# Altium schematic sheet Led_Matrix_Main.schDoc
size A3; CompanyName: Anfaengineering; Organization: Anfaengineering; Address1: Timisoara; Address2: Romania; SheetNumber: 3; SheetTotal: 5
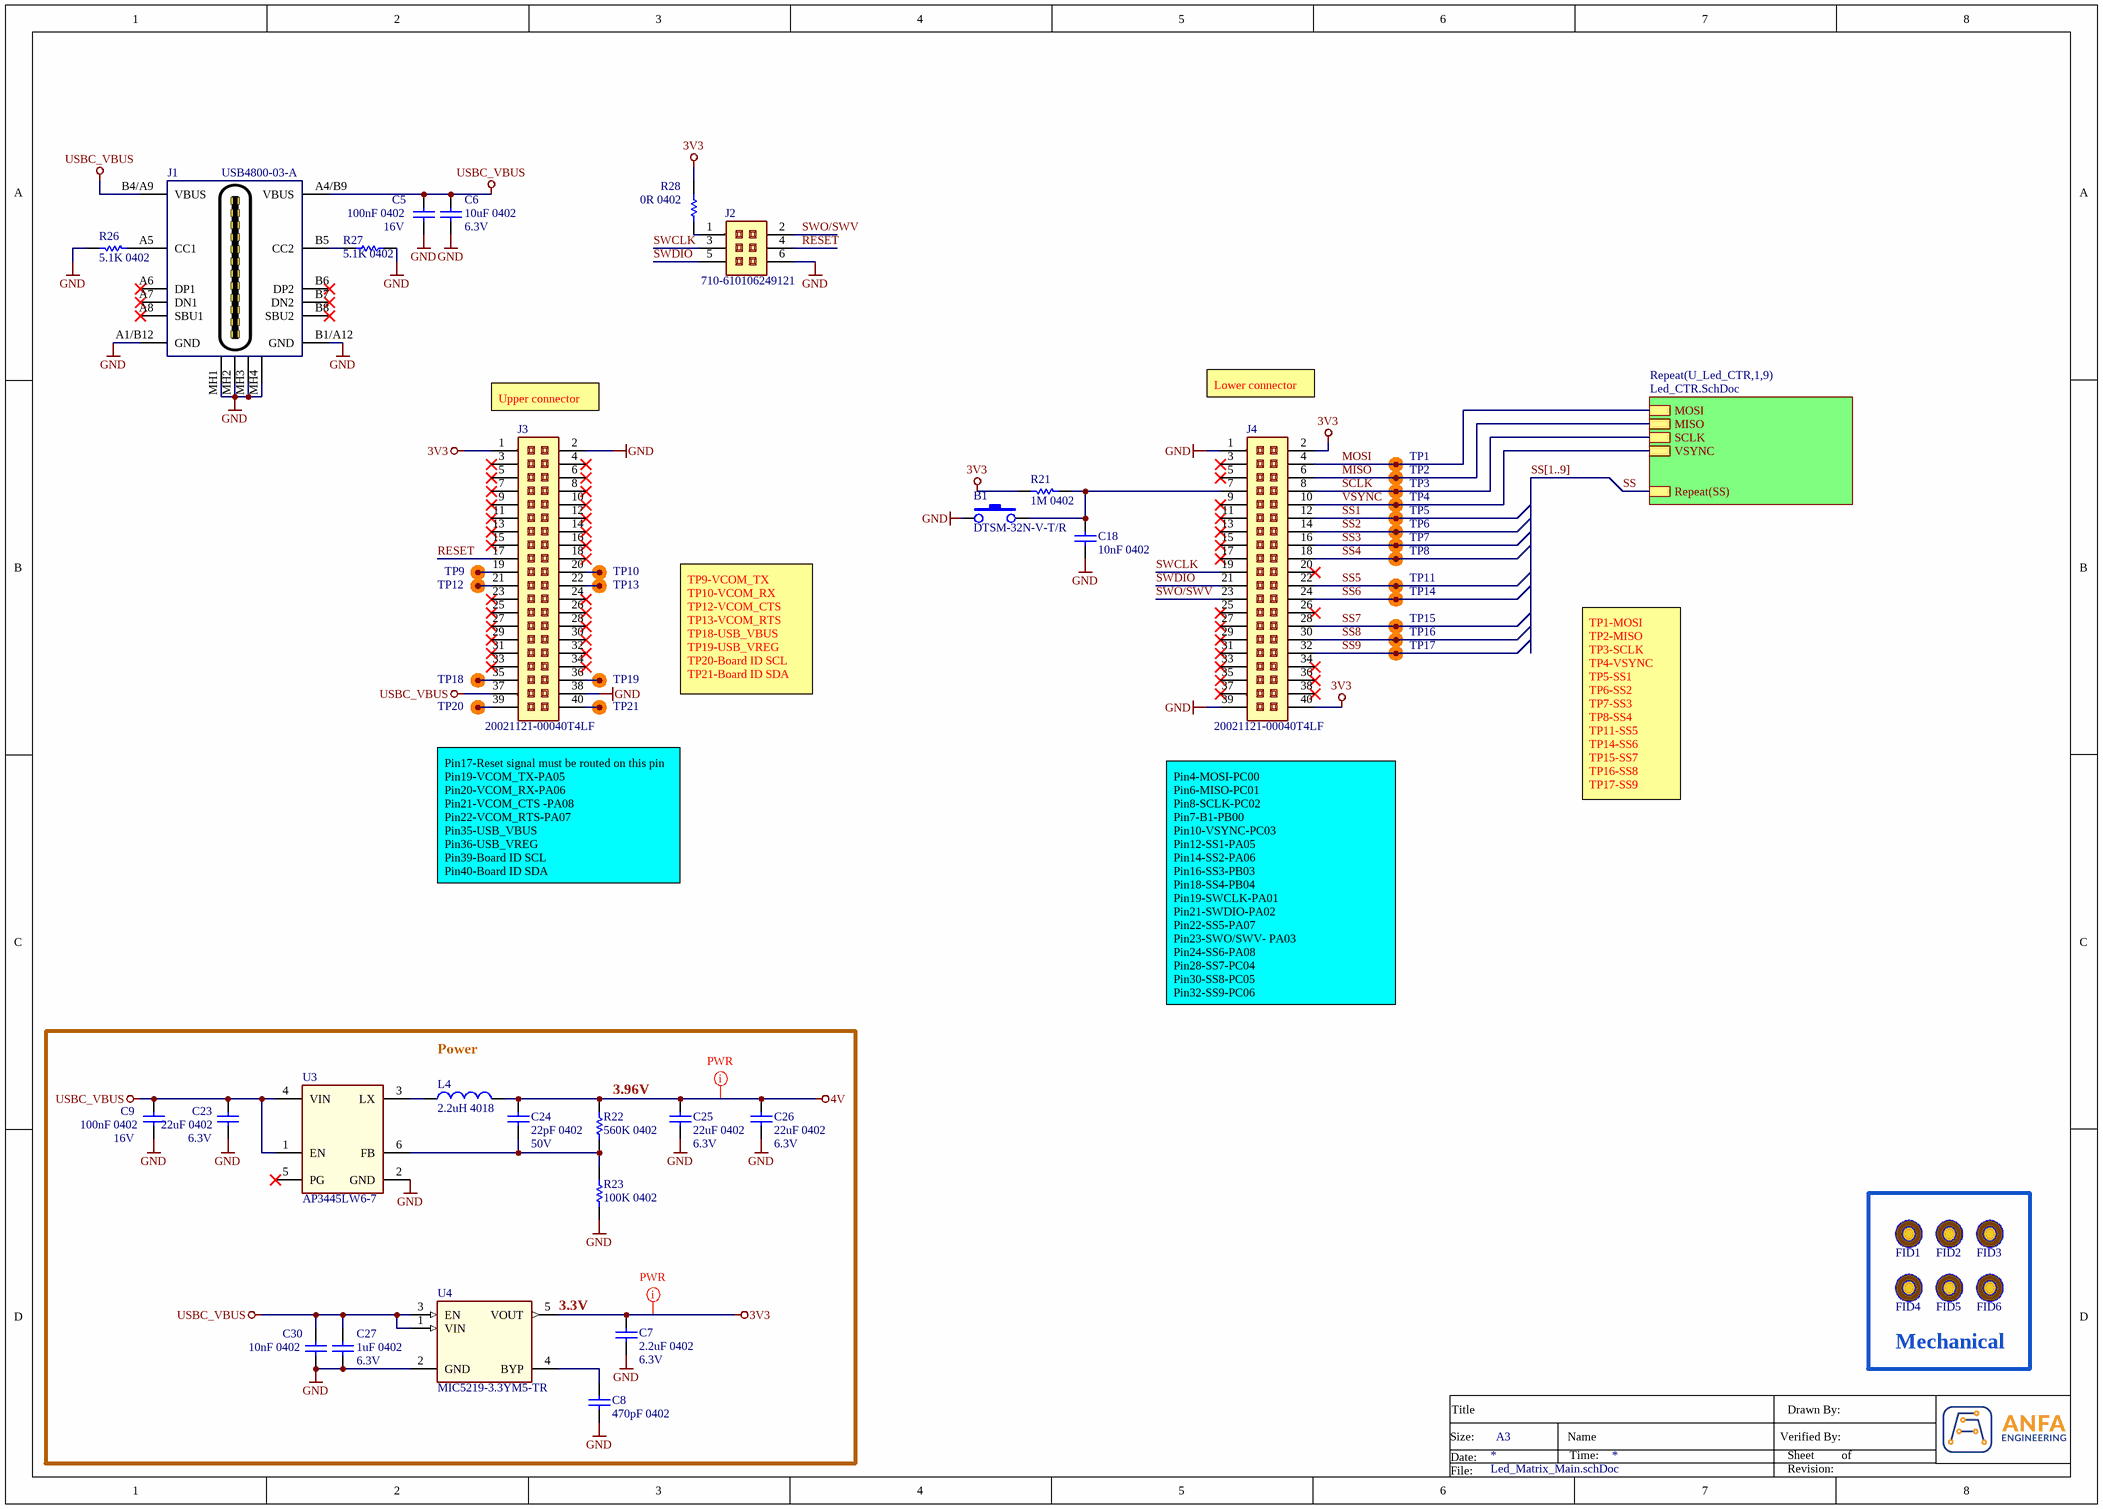
[diagram p0: Led_Matrix_Main.schDoc]

## Parts
B1  DTSM-32N-V-T/R  [DTSM-32N-V]
C5  100nF 0402  Voltage: 16V  [CAPC0402(1005)70]
C6  10uF 0402  Voltage: 6.3V  [CAPC0402(1005)70]
C7  2.2uF 0402  Voltage: 6.3V  [CAPC0402(1005)70]
C8  470pF 0402  [CAPC0402(1005)33]
C9  100nF 0402  Voltage: 16V  [CAPC0402(1005)70]
C18  10nF 0402  [CAPC0402(1005)33]
C23  22uF 0402  Voltage: 6.3V  [CAPC0402(1005)70]
C24  22pF 0402  Voltage: 50V  [CAPC0402(1005)70]
C25  22uF 0402  Voltage: 6.3V  [CAPC0402(1005)70]
C26  22uF 0402  Voltage: 6.3V  [CAPC0402(1005)70]
C27  1uF 0402  Voltage: 6.3V  [CAPC0402(1005)70]
C30  10nF 0402  [CAPC0402(1005)33]
FID1  (no value)  [FID1]  (no BOM)
FID2  (no value)  [FID1]  (no BOM)
FID3  (no value)  [FID1]  (no BOM)
FID4  (no value)  [FID1]  (no BOM)
FID5  (no value)  [FID1]  (no BOM)
FID6  (no value)  [FID1]  (no BOM)
J1  USB4800-03-A  [USB4800-03-A]
J2  710-610106249121  [HDR_2X3_2.54mm_MALE]
J3  20021121-00040T4LF  [20021121-00040T4LF]
J4  20021121-00040T4LF  [20021121-00040T4LF]
L4  2.2uH 4018  [SMD4018]
R21  1M 0402  [RESC0402(1005)]
R22  560K 0402  [RESC0402(1005)]
R23  100K 0402  [RESC0402(1005)]
R26  5.1K 0402  [RESC0402(1005)]
R27  5.1K 0402  [RESC0402(1005)]
R28  0R 0402  [RESC0402(1005)]
TP1  (no value)  [TP_SMD]  (no BOM)
TP2  (no value)  [TP_SMD]  (no BOM)
TP3  (no value)  [TP_SMD]  (no BOM)
TP4  (no value)  [TP_SMD]  (no BOM)
TP5  (no value)  [TP_SMD]  (no BOM)
TP6  (no value)  [TP_SMD]  (no BOM)
TP7  (no value)  [TP_SMD]  (no BOM)
TP8  (no value)  [TP_SMD]  (no BOM)
TP9  (no value)  [TP_SMD]  (no BOM)
TP10  (no value)  [TP_SMD]  (no BOM)
TP11  (no value)  [TP_SMD]  (no BOM)
TP12  (no value)  [TP_SMD]  (no BOM)
TP13  (no value)  [TP_SMD]  (no BOM)
TP14  (no value)  [TP_SMD]  (no BOM)
TP15  (no value)  [TP_SMD]  (no BOM)
TP16  (no value)  [TP_SMD]  (no BOM)
TP17  (no value)  [TP_SMD]  (no BOM)
TP18  (no value)  [TP_SMD]  (no BOM)
TP19  (no value)  [TP_SMD]  (no BOM)
TP20  (no value)  [TP_SMD]  (no BOM)
TP21  (no value)  [TP_SMD]  (no BOM)
U3  AP3445LW6-7  [SOT23-6]
U4  MIC5219-3.3YM5-TR  [SOT23-5]

## Blocks framed on the sheet
Mechanical: FID1-FID6

## Sub-sheets
Repeat(U_Led_CTR,1,9) = Led_CTR.SchDoc: MOSI, MISO, VSYNC, SCLK, Repeat(SS)

## Nets
3V3: C7.2 J3.1 J4.2 J4.40 R21.1 R28.2 U4.5(VOUT)
4V: C24.2 C25.1 C26.1 L4.2 R22.2
GND: B1.2 C5.1 C6.1 C7.1 C8.1 C9.1 C18.1 C23.1 C25.2 C26.2 C27.1 C30.1 J1.A1/B12(GND) J1.B1/A12(GND) J1.MH1 J1.MH2 J1.MH3 J1.MH4 J2.6 J3.2 J3.38 J4.1 J4.39 R23.1 R26.2 R27.2 U3.2(GND) U4.2(GND)
USBC_VBUS: C5.2 C6.2 C9.2 C23.2 C27.2 C30.2 J1.A4/B9(VBUS) J1.B4/A9(VBUS) J3.37 U3.1(EN) U3.4(VIN) U4.1(VIN) U4.3(EN)
MISO: J4.6 TP2.1 ; sheet Repeat(U_Led_CTR,1,9)/MISO
MOSI: J4.4 TP1.1 ; sheet Repeat(U_Led_CTR,1,9)/MOSI
RESET: J2.4 J3.17
SCLK: J4.8 TP3.1 ; sheet Repeat(U_Led_CTR,1,9)/SCLK
SS: sheet Repeat(U_Led_CTR,1,9)/Repeat(SS)
SS1: J4.12 TP5.1
SS2: J4.14 TP6.1
SS3: J4.16 TP7.1
SS4: J4.18 TP8.1
SS5: J4.22 TP11.1
SS6: J4.24 TP14.1
SS7: J4.28 TP15.1
SS8: J4.30 TP16.1
SS9: J4.32 TP17.1
SWCLK: J2.3 J4.19
SWDIO: J2.5 J4.21
SWO/SWV: J2.2 J4.23
VSYNC: J4.10 TP4.1 ; sheet Repeat(U_Led_CTR,1,9)/VSYNC
NetB1_1: B1.1 C18.2 J4.7 R21.2
NetC8_2: C8.2 U4.4(BYP)
NetC24_1: C24.1 R22.1 R23.2 U3.6(FB)
NetJ1_A5: J1.A5(CC1) R26.1
NetJ1_B5: J1.B5(CC2) R27.1
NetJ2_1: J2.1 R28.1
NetJ3_19: J3.19 TP9.1
NetJ3_20: J3.20 TP10.1
NetJ3_21: J3.21 TP12.1
NetJ3_22: J3.22 TP13.1
NetJ3_35: J3.35 TP18.1
NetJ3_36: J3.36 TP19.1
NetJ3_39: J3.39 TP20.1
NetJ3_40: J3.40 TP21.1
NetL4_1: L4.1 U3.3(LX)

Not connected (* = marked no-connect by the designer): J1 A6(DP1)* A7(DN1)* A8(SBU1)* B6(DP2)* B7(DN2)* B8(SBU2)*; J3 3* 4* 5* 6* 7* 8* 9* 10* 11* 12* 13* 14* 15* 16* 18* 23* 24* 25* 26* 27* 28* 29* 30* 31* 32* 33* 34*; J4 3* 5* 9* 11* 13* 15* 17* 20* 25* 26* 27* 29* 31* 33* 34* 35* 36* 37* 38*; U3 5(PG)*

## Buses and harness runs
bus SS[1..9]

## Layout directives
net class Power_trace: 3V3, 4V

## Notes on the sheet
- (near J3) Upper connector
- Lower connector
- TP9-VCOM_TX
  TP10-VCOM_RX
  TP12-VCOM_CTS
  TP13-VCOM_RTS
  TP18-USB_VBUS
  TP19-USB_VREG
  TP20-Board ID SCL
  TP21-Board ID SDA
- TP1-MOSI
  TP2-MISO
  TP3-SCLK
  TP4-VSYNC
  TP5-SS1
  TP6-SS2
  TP7-SS3
  TP8-SS4
  TP11-SS5
  TP14-SS6
  TP15-SS7
  TP16-SS8
  TP17-SS9
- Pin17-Reset signal must be routed on this pin
  Pin19-VCOM_TX-PA05
  Pin20-VCOM_RX-PA06
  Pin21-VCOM_CTS -PA08
  Pin22-VCOM_RTS-PA07
  Pin35-USB_VBUS
  Pin36-USB_VREG
  Pin39-Board ID SCL
  Pin40-Board ID SDA
- (near L4) Power
- Pin4-MOSI-PC00
  Pin6-MISO-PC01
  Pin8-SCLK-PC02
  Pin7-B1-PB00
  Pin10-VSYNC-PC03
  Pin12-SS1-PA05
  Pin14-SS2-PA06
  Pin16-SS3-PB03
  Pin18-SS4-PB04
  Pin19-SWCLK-PA01
  Pin21-SWDIO-PA02
  Pin22-SS5-PA07
  Pin23-SWO/SWV- PA03
  Pin24-SS6-PA08
  Pin28-SS7-PC04
  Pin30-SS8-PC05
  Pin32-SS9-PC06
- (near R22) 3.96V
- 3.3V
- Title
- Size:
- Date:
- A3
- Time:
- Name
- Verified By:
- Sheet
- Drawn By:
- of
- File:
- Revision:

## Library data of the parts
B1 = SW-TACTILE_ON/OFF_DTSM-32N-V-T/R: SWITCH TACTILE SMT 3.5mm * 6mm , brown 160gf; Manufacturer: Diptronics; Anfa_PN: QSW0008; No. of pins: 2; Current Rating: 50mA; Component loss: 6; Supplier 1: Mouser; Min Operating Temperature: -20°C; Max Operating Temperature: 70°C; Supplier Part Number 1: 113-DTSM32NVTR; Manufacturer Part Number: DTSM-32N-V-T/R; Price: 0.44; Value: DTSM-32N-V-T/R
C5 C9 = C_100nF_0402_16V_X7R: Surface Mount Ceramic Multilayer Capacitor 100nF, ± 10%, X7R, 16V, 0402; Manufacturer: Murata; Manufacturer Part Number: GCM155R71C104KA55D; Anfa_PN: ALC0069; Component loss: 20; Min Operating Temperature: -55°C; Max Operating Temperature: 125°C; Tolerance: 10%; Supplier Part Number 1: 81-GCM155R71C104KA5D; Supplier 1: Mouser; Price: 0.017; Value: 100nF 0402
C6 = C_10uF_0402_6.3V_X5R: Surface Mount Ceramic Multilayer Capacitor 10uF, ± 20 %, X5R, 6.3V, 0402; Manufacturer: Murata; Manufacturer Part Number: GRM155R60J106ME15D; Tolerance: 20%; Anfa_PN: ALC0071; Alternate Anfa_PN: ALC0065; Component loss: 20; Min Operating Temperature: -55°C; Max Operating Temperature: 85°C; Supplier 1: Mouser; Supplier Part Number 1: 81-GRM155R60J106ME5D; Price: 0.067; Value: 10uF 0402
C7 = C_2.2uF_0402_6.3V_X5R: Surface Mount Ceramic Multilayer Capacitor 2.2uF, ± 10%, X5R, 6.3V, 0402; Manufacturer: Murata; Manufacturer Part Number: GRM155R60J225KE01D; Anfa_PN: ALC0084; Component loss: 20; Supplier 1: Mouser; Supplier Part Number 1: 81-GRM155R60J225K01D; Max Operating Temperature: 85°C; Min Operating Temperature: -55°C; Price: 0.038; Tolerance: 10%; Value: 2.2uF 0402
C8 = C_470pF_0402_10V_C0G: Multilayer Ceramic Capacitors MLCC - SMD/SMT 0402 470pF 10V C0G 10%; Manufacturer: Vishay; Manufacturer Part Number: VJ0402A471KXQPW1BC; Anfa_PN: QC0027; Component loss: 20; Min Operating Temperature: -55°C; Max Operating Temperature: 125°C; Tolerance: 10%; Footprint: 0402; Price: 0.12; Value: 470pF 0402; Supplier 1: Mouser; Supplier Part Number 1: 77-VJ0402A471KXQPBC; Voltage: 10V
C18 C30 = C_10nF_0402_50V_X7R: Cap Ceramic 0.01uF 50V X7R 10% SMD 0402 125C Paper T/R; Manufacturer: Vishay Vitramon; Manufacturer Part Number: VJ0402Y103KXACW1BC; Anfa_PN: ALC0046; Component loss: 20; Min Operating Temperature: -55°C; Max Operating Temperature: 125°C; Tolerance: 10%; Supplier Part Number 1: 77-VJ0402Y103KXACWBC; Supplier 1: Mouser; Price: 0.033; Value: 10nF 0402; Voltage: 50V; Footprint: 0402
C23 C25 C26 = C_22uF_0402_6.3V_X5R: Multilayer Ceramic Capacitors MLCC - SMD/SMT 6.3V 22uF X5R 0402 20%; Manufacturer: KYOCERA AVX; Manufacturer Part Number: 04026D226MAT2A; Anfa_PN: QC0026; Component loss: 20; Max Operating Temperature: 85°C; Min Operating Temperature: -55°C; Price: 0.14; Tolerance: 20%; Value: 22uF 0402; Supplier 1: Mouser; Supplier Part Number 1: 581-04026D226MAT2A
C24 = C_22pF_0402_50V_C0G: Surface Mount Ceramic Multilayer Capacitor 22pF, ± 5%, C0G, 50V, 0402; Manufacturer: Kyocera AVX; Manufacturer Part Number: 04025A220JAT2A; Anfa_PN: QC0005; Component loss: 20; Max Operating Temperature: 125°C; Min Operating Temperature: -55°C; Price: 0.0162; Supplier 1: TME; Supplier Part Number 1: 04025A220JAT2A; Tolerance: 5%; Value: 22pF 0402
C27 = C_1uF_0402_6.3V_X5R: Surface Mount Ceramic Multilayer Capacitor 1uF, ± 20%, X5R, 6.3V, 0402; Manufacturer: Murata; Manufacturer Part Number: GRM153R60J105ME15D; Anfa_PN: ALC0088; Component loss: 20; Min Operating Temperature: -55°C; Max Operating Temperature: 85°C; Tolerance: 20%; Supplier Part Number 1: 81-GRM153R60J105ME1D; Supplier 1: Mouser; Price: 0.042; Value: 1uF 0402
FID1-FID6 = MECH_FIDUCIAL: Fiducial with various available footprints
J1 = USB-C_3.0_USB4800-03-A: USB Connectors USB2.0 Type C Rcpt, SMT, Hrz, 3.5mm elevated, 16 Pin; Manufacturer: GCT; Anfa_PN: QCN0028; No. of pins: 16; Pitch: 0.5mm; Component loss: 1; Manufacturer Part Number: USB4800-03-A; Min Operating Temperature: -25°C; Max Operating Temperature: 85°C; Price: 1.73; Value: USB4800-03-A; Alternate Anfa_PN: -; Supplier 1: Mouser; Supplier Part Number 1: 640-USB4800-03-A
J2 = HEADER_2X3_RA_MALE_2.54mm_710-610106249121: Headers & Wire Housings WR-PHD 2.54mm Hdr 6P Dual RA Gold; Manufacturer: Wurth Elektronik; Anfa_PN: QCN0026; Component loss: 1; Current Rating: 3 A; No. of pins: 6; Manufacturer Part Number: 610106249121; Max Operating Temperature: 105°C; Min Operating Temperature: -40 °C; Pitch: 2.54mm; Price: 1.64; Value: 710-610106249121; Supplier 1: Mouser; Supplier Part Number 1: 710-610106249121
J3 J4 = HEADER_2X20_RA_MALE_1,27mm_649-221121-00040T4LF: Headers & Wire Housings 1.27mm BTB, Hdr, SMT Unshrd, 40 P, Tub; Manufacturer: Amphenol FCI; Anfa_PN: QCN0027; Component loss: 1; Current Rating: 1 A; No. of pins: 40; Manufacturer Part Number: 20021121-00040T4LF; Max Operating Temperature: 125°C; Min Operating Temperature: -55 °C; Pitch: 1.27mm; Price: 3.13; Value: 20021121-00040T4LF; Supplier 1: Mouser; Supplier Part Number 1: 649-221121-00040T4LF
L4 = L_2.2uH_3.11A: Inductor Power Shielded Wirewound, 2.2uH, 20%, Saturation Current 3.11A, 50.4 mOhms DCR, SMD4018; Manufacturer: Taiyo Yuden; Manufacturer Part Number: NRS4018T2R2MDGJV; Anfa_PN: ALI0034; Component loss: 10; Min Operating Temperature: -25°C; Max Operating Temperature: 125°C; Tolerance: 20%; Supplier 1: Mouser; Supplier Part Number 1: 963-NRS4018T2R2MDGJV; Price: 0.443; Value: 2.2uH 4018; Maximum DC Res: 50.4 mOhms; Saturation Current: 3.11 A
R21 = R_1M_0402_5%: Resistor: thick film; SMD; 0402; 1MΩ; 63mW; ±5%; -55÷155°C; Manufacturer: ROYAL OHM; Manufacturer Part Number: 0402WGJ0105TCE; Anfa_PN: ALR0128; Component loss: 20; Supplier 1: TME; Supplier Part Number 1: SMD0402-1M; Max Operating Temperature: 155°C; Min Operating Temperature: -55°C; Power: 63 mW; Price: 0.011; Tolerance: 5%; Value: 1M 0402
R22 = R_560K_0402_1%: Rezistor: thick film; SMD; 0402; 560kΩ; 63mW; ±1%; -55÷155°C; Manufacturer: ROYAL OHM; Manufacturer Part Number: 0402WGJ0564TCE; Anfa_PN: ALR0151; Component loss: 20; Supplier 1: TME; Min Operating Temperature: -55°C; Max Operating Temperature: 155°C; Tolerance: 1%; Power: 63 mW; Price: 0.00925; Supplier Part Number 1: SMD0402-560K; Value: 560K 0402
R23 = R_100K_0402_1%: Resistor: thick film; SMD; 0402; 100KΩ; 63mW; ±1%; -55÷155°C; Manufacturer: Yageo; Manufacturer Part Number: RC0402FR-07100KL; Anfa_PN: ALR0133; Component loss: 20; Min Operating Temperature: -55°C; Max Operating Temperature: 155°C; Tolerance: 1%; Supplier 1: TME; Supplier Part Number 1: RC0402FR-07100K; Power: 63 mW; Price: 0.0091; Value: 100K 0402
R26 R27 = R_5.1K_0402_1%: Resistor: thick film; SMD; 0402; 5.1KΩ; 63mW; ±1%; -55÷155°C; Manufacturer: Vishay; Manufacturer Part Number: CRCW04025K10FKTDBC; Anfa_PN: ALR0099; Component loss: 20; Tolerance: 1%; Supplier 1: TME; Supplier Part Number 1: CRCW04025K10FKTDBC; Max Operating Temperature: 155°C; Min Operating Temperature: -55°C; Power: 63 mW; Price: 0.01226; Value: 5.1K 0402
R28 = R_0R_0402_5%: Resistor: thick film; SMD; 0402; 0R; 63mW; ±5%; -55÷155°C; Manufacturer: Royal Electronic Factory; Manufacturer Part Number: 0402WGJ0000TCE; Anfa_PN: ALR0135; Component loss: 20; Supplier 1: TME; Supplier Part Number 1: 0402WGJ0000TCE; Max Operating Temperature: 155°C; Min Operating Temperature: -55°C; Power: 63 mW; Price: 0.011; Tolerance: 5%; Value: 0R 0402
TP1-TP21 = TP_1mm_OLD: Test Point 1mm
U3 = VR_BUCK_AP3445LW6-7: Buck Switching Regulator IC Positive Adjustable 0.6V 1 Output 2A SOT-23-6; Manufacturer: Diodes Incorporated; Anfa_PN: ALV0041; Max Input Voltage: 5.5V; Min Input Voltage: 2.7V; Component loss: 10; Supplier 1: Mouser; Manufacturer Part Number: AP3445LW6-7; Supplier Part Number 1: 621-AP3445LW6-7; Value: AP3445LW6-7; Max Operating Temperature: 85°C; Max Output Current: 2A; Max Output Voltage: 5.5V; Min Operating Temperature: -40°C; Min Output Voltage: 0.6V; Price: 0.47
U4 = VR_LDO_MIC5219-3.3YM5-TR: LDO Voltage Regulators, Adjustable Output Voltage, Output Current 500mA, SOT-23-5; Manufacturer: Microchip Technology; Anfa_PN: QV0009; Max Input Voltage: 12 V; Max Output Voltage: 17V; Min Input Voltage: 2.7V; Min Output Voltage: 1.2V; Component loss: 6; Manufacturer Part Number: MIC5219-3.3YM5-TR; Max Operating Temperature: 125°C; Max Output Current: 500mA; Min Operating Temperature: -40°C; Price: 0.695; Value: MIC5219-3.3YM5-TR; Supplier 1: Mouser; Supplier Part Number 1: 998-MIC5219-3.3YM5TR